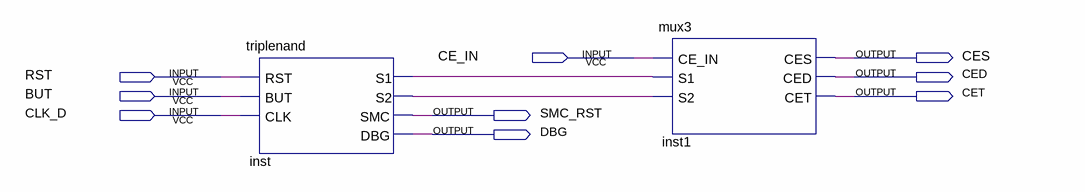
[diagram p0: schematic sheet]
// Quartus schematic mux_triple.bdf as structural Verilog: 2 symbols, 9 pins
module mux_triple (
  input  CE_IN,
  input  RST,
  input  BUT,
  input  CLK_D,
  output CES,
  output CED,
  output CET,
  output SMC_RST,
  output DBG
);

  wire inst_s1, inst_s2;

  triplenand inst (.RST(RST), .BUT(BUT), .CLK(CLK_D), .S1(inst_s1), .S2(inst_s2), .SMC(SMC_RST), .DBG(DBG));
  mux3 inst1 (.CE_IN(CE_IN), .S1(inst_s1), .S2(inst_s2), .CES(CES), .CED(CED), .CET(CET));
endmodule
